# EAGLE design myBox (EAGLE 6.6.0)
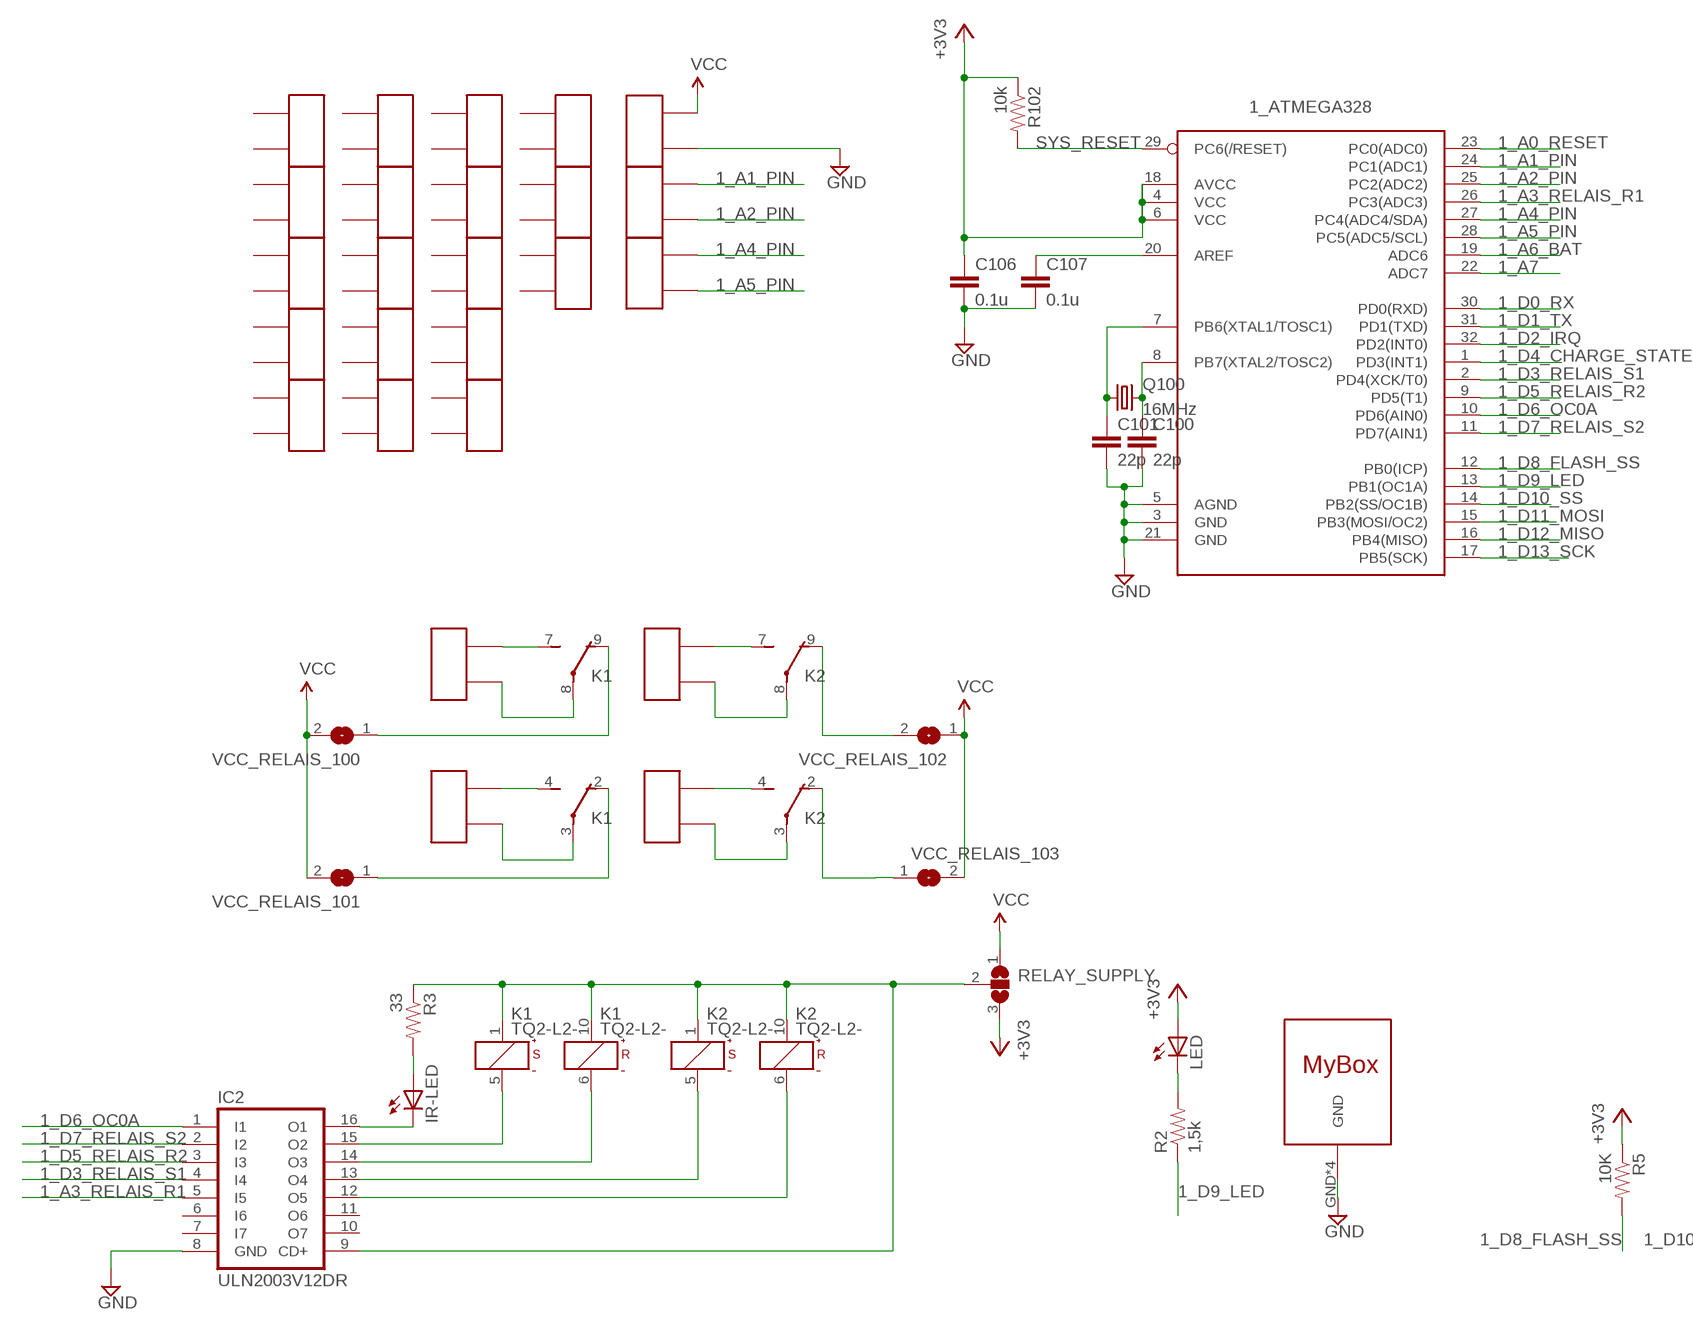
[diagram p0: schematic, sheet 1, part 1 of 2]
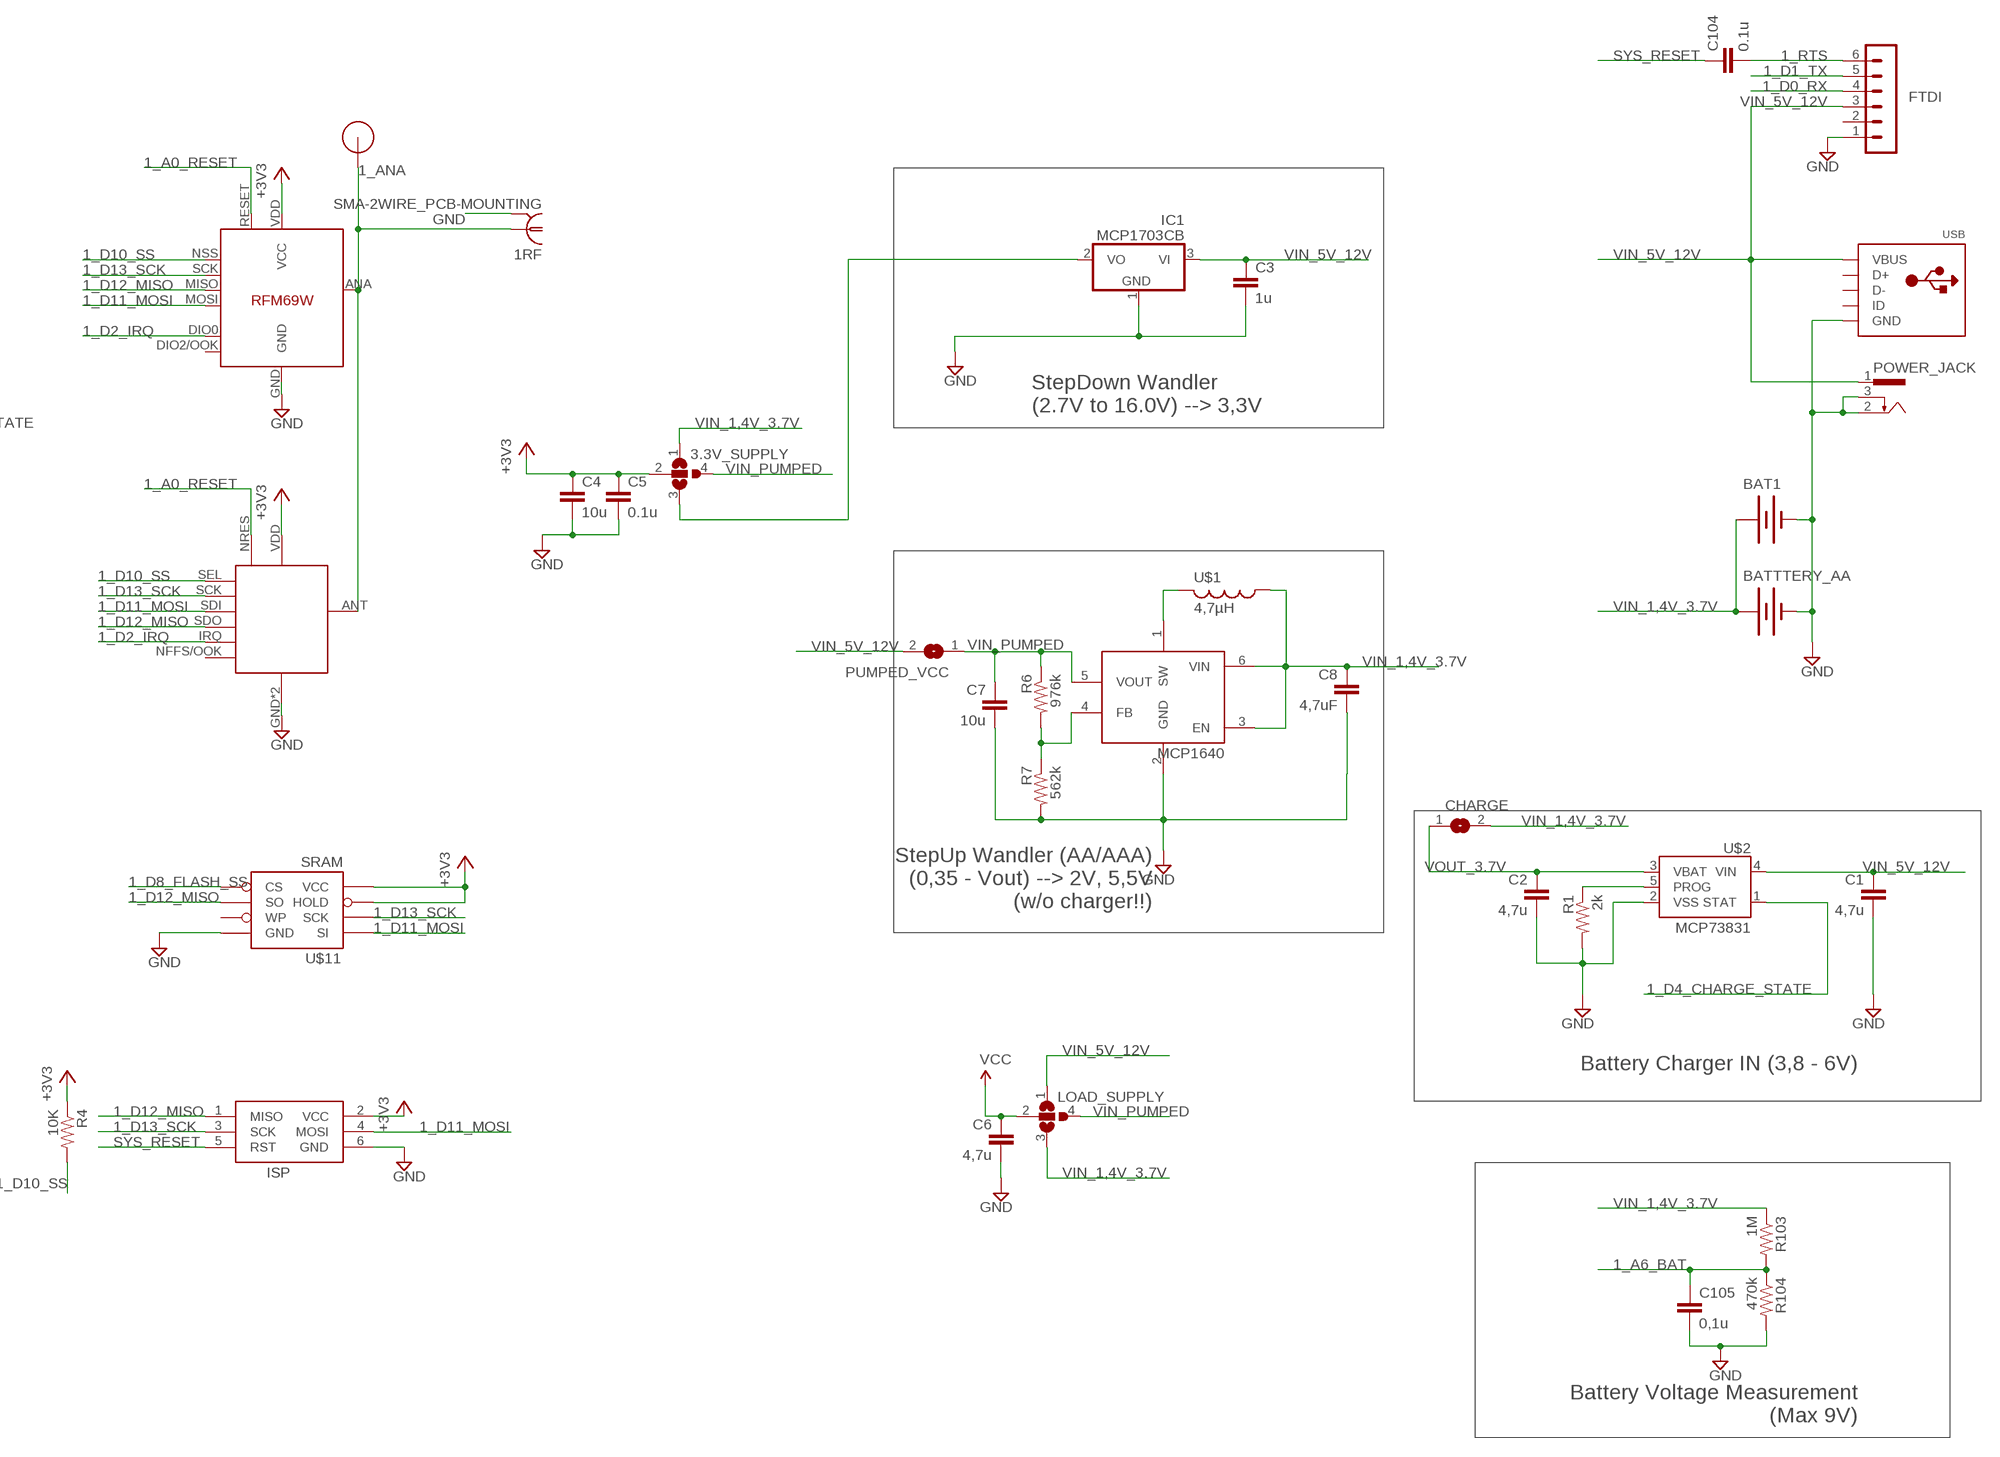
[diagram p1: schematic, sheet 1, part 2 of 2]

## Parts
1_ATMEGA328  ATMega-328  ATMEGA168/328TQFP32  [TQFP32-08]
1_RFM12  RFM12B_MINPADS  [RFM12B-MINPADS]
1_RFM69  RFM69_MINIPADS  [RFM69W-MINPADS]
1RF  SMA-2WIRE_PCB-MOUNTING  [J01151A0931]
3.3V_SUPPLY  SJ3W  [SJ_3]
ADC1  HDR_2PIN  [1X02_NS]
ADC2  HDR_2PIN  [1X02_NS]
BAT1  BATTERY  [BATTERY-CR2]
BATTTERY_AA  BATTERYAA  [BATTERY-AA]
C1  4,7u  CAP0603-CAP  [0603-CAP]
C2  4,7u  CAP0603-CAP  [0603-CAP]
C3  1u  CAP0603-CAP  [0603-CAP]
C4  10u  CAP0603-CAP  [0603-CAP]
C5  0.1u  CAP0603-CAP  [0603-CAP]
C6  4,7u  CAP0603-CAP  [0603-CAP]
C7  10u  CAP0603-CAP  [0603-CAP]
C8  4,7uF  CAP0603-CAP  [0603-CAP]
C100  22p  CAP0603-CAP  [0603-CAP]
C101  22p  CAP0603-CAP  [0603-CAP]
C104  0.1u  CAP0603-CAP  [0603-CAP]
C105  0,1u  CAP0603-CAP  [0603-CAP]
C106  0.1u  CAP0603-CAP  [0603-CAP]
C107  0.1u  CAP0603-CAP  [0603-CAP]
CHARGE  SJ  [SJ]
FTDI  FTDI  MA06-1  [MA06-1]
IC1  MCP1703CB  [SOT23]
IC2  ULN2003V12DR  ULN2003AD  [SO16]
IR-LED  LED5MM  [LED5MM]
IR/RELAY_SATELLITE  MY-BOX  [MY-BOX]
ISP  AVRISP  [AVRISP-EDGE]
K1  TQ2-L2-  [TQ2]
K2  TQ2-L2-  [TQ2]
LED  LED3MM  [LED3MM]
LOAD_SUPPLY  SJ3W  [SJ_3]
POWER_JACK  LUMBERG_1613-200-62  [733980-62]
PUMPED_VCC  SJ  [SJ]
Q100  16MHz  CRYSTALHC49S  [HC49/S]
R1  2k  RESISTOR0603-RES  [0603-RES]
R2  1,5k  RESISTOR0603-RES  [0603-RES]
R3  33  RESISTOR0603-RES  [0603-RES]
R4  10K  RESISTOR0603-RES  [0603-RES]
R5  10K  RESISTOR0603-RES  [0603-RES]
R6  976k  RESISTOR0603-RES  [0603-RES]
R7  562k  RESISTOR0603-RES  [0603-RES]
R102  10k  RESISTOR0603-RES  [0603-RES]
R103  1M  RESISTOR0603-RES  [0603-RES]
R104  470k  RESISTOR0603-RES  [0603-RES]
RELAY_SUPPLY  SJ2W  [SJ_2]
U1  MCP1640  [SOT23-6]
U$1  4,7µH  INDUCTOR_B82462G  [INDUCTOR_EPCOS]
U$2  MCP73831  [SOT23-5]
U$3  HDR_2PIN  [1X02_NS]
U$4  HDR_2PIN  [1X02_NS]
U$5  HDR_2PIN  [1X02_NS]
U$6  HDR_2PIN  [1X02_NS]
U$7  HDR_2PIN  [1X02_NS]
U$8  HDR_2PIN  [1X02_NS]
U$9  HDR_2PIN  [1X02_NS]
U$10  HDR_2PIN  [1X02_NS]
U$11  SRAM  SRAM_32K256JEDEC_3.9MM  [LOWPOWERLAB_SO08]
U$12  HDR_2PIN  [1X02_NS]
U$13  HDR_2PIN  [1X02_NS]
U$14  HDR_2PIN  [1X02_NS]
U$15  HDR_2PIN  [1X02_NS]
U$16  HDR_2PIN  [1X02_NS]
U$17  HDR_2PIN  [1X02_NS]
U$18  RFM12B_ANTENNA  [RFM12B-ANTENNA]
U$19  HDR_2PIN  [1X02_NS]
U$20  HDR_2PIN  [1X02_NS]
U$21  HDR_2PIN  [1X02_NS]
U$22  HDR_2PIN  [1X02_NS]
U$23  HDR_2PIN  [1X02_NS]
U$24  HDR_2PIN  [1X02_NS]
U$25  HDR_2PIN  [1X02_NS]
U$26  HDR_2PIN  [1X02_NS]
USB  USBMINIB  [USB-MINIB]
VCC  HDR_2PIN  [1X02_NS]
VCC_RELAIS_100  SJ  [SJ]
VCC_RELAIS_101  SJ  [SJ]
VCC_RELAIS_102  SJ  [SJ]
VCC_RELAIS_103  SJ  [SJ]

## Nets
1_A0_RESET: 1_ATMEGA328.23(PC0(ADC0)) 1_RFM12.NRES 1_RFM69.RESET
1_A1_PIN: 1_ATMEGA328.24(PC1(ADC1)) ADC1.1
1_A2_PIN: 1_ATMEGA328.25(PC2(ADC2)) ADC1.2
1_A3_RELAIS_R1: 1_ATMEGA328.26(PC3(ADC3)) IC2.5(I5)
1_A4_PIN: 1_ATMEGA328.27(PC4(ADC4/SDA)) ADC2.1
1_A5_PIN: 1_ATMEGA328.28(PC5(ADC5/SCL)) ADC2.2
1_A6_BAT: 1_ATMEGA328.19(ADC6) C105.1 R103.2 R104.1
1_A7: 1_ATMEGA328.22(ADC7)
1_ANA [ANT]: 1_RFM12.ANT 1_RFM69.ANA(ANT) 1RF.1 U$18.P$1
1_AREF: 1_ATMEGA328.20(AREF) C107.1
1_D0_RX: 1_ATMEGA328.30(PD0(RXD)) FTDI.4
1_D1_TX: 1_ATMEGA328.31(PD1(TXD)) FTDI.5
1_D2_IRQ: 1_ATMEGA328.32(PD2(INT0)) 1_RFM12.IRQ 1_RFM69.DIO0(DIO0/IRQ)
1_D3_RELAIS_S1: 1_ATMEGA328.2(PD4(XCK/T0)) IC2.4(I4)
1_D4_CHARGE_STATE: 1_ATMEGA328.1(PD3(INT1)) U$2.1(STAT)
1_D5_RELAIS_R2: 1_ATMEGA328.9(PD5(T1)) IC2.3(I3)
1_D6_OC0A: 1_ATMEGA328.10(PD6(AIN0)) IC2.1(I1)
1_D7_RELAIS_S2: 1_ATMEGA328.11(PD7(AIN1)) IC2.2(I2)
1_D8_FLASH_SS: 1_ATMEGA328.12(PB0(ICP)) R5.2 U$11.1_CS(CS)
1_D9_LED: 1_ATMEGA328.13(PB1(OC1A)) R2.1
1_D10_SS: 1_ATMEGA328.14(PB2(SS/OC1B)) 1_RFM12.SEL 1_RFM69.NSS(SEL) R4.2
1_D11_MOSI: 1_ATMEGA328.15(PB3(MOSI/OC2)) 1_RFM12.SDI(SDI/MOSI) 1_RFM69.MOSI ISP.4(MOSI) U$11.5_SI(SI)
1_D12_MISO: 1_ATMEGA328.16(PB4(MISO)) 1_RFM12.SDO(SDO/MISO) 1_RFM69.MISO ISP.1(MISO) U$11.2_SO(SO)
1_D13_SCK: 1_ATMEGA328.17(PB5(SCK)) 1_RFM12.SCK 1_RFM69.SCK ISP.3(SCK) U$11.6_SCK(SCK)
1_RTS: C104.2 FTDI.6
+3V3 [power]: 1_ATMEGA328.4(VCC) 1_ATMEGA328.6(VCC) 1_ATMEGA328.18(AVCC) 1_RFM12.VDD 1_RFM69.VDD(VCC) 3.3V_SUPPLY.2 C4.1 C5.1 C106.1 ISP.2(VCC) LED.A R4.1 R5.1 R102.1 RELAY_SUPPLY.3 U$11.7_HOLD(HOLD) U$11.8_VCC(VCC)
GND [power]: 1_ATMEGA328.3(GND) 1_ATMEGA328.5(AGND) 1_ATMEGA328.21(GND) 1_RFM12.GND 1_RFM12.GND1(GND) 1_RFM69.GND 1RF.G@1 1RF.G@2 1RF.G@3 1RF.G@4 BAT1.GND@1(-) BATTTERY_AA.GND@1(-) C1.2 C2.2 C3.2 C4.2 C5.2 C6.2 C7.2 C8.2 C100.2 C101.2 C105.2 C106.2 C107.2 FTDI.1 IC1.1(GND) IC2.8(GND) IR/RELAY_SATELLITE.GND IR/RELAY_SATELLITE.GND1(GND) IR/RELAY_SATELLITE.GND2(GND) IR/RELAY_SATELLITE.GND3(GND) ISP.6(GND) POWER_JACK.2 POWER_JACK.3 R1.2 R7.2 R104.2 U1.2(GND) U$2.2(VSS) U$11.4_GND(GND) USB.GND VCC.2
N$1: 1_ATMEGA328.7(PB6(XTAL1/TOSC1)) C101.1 Q100.1
N$2: R1.1 U$2.5(PROG)
N$3: IR-LED.A R3.2
N$4: IC2.16(O1) IR-LED.K(C)
N$5: IC2.15(O2) K1.5(S:-)
N$6: IC2.14(O3) K1.6(R:-)
N$7: 1_ATMEGA328.8(PB7(XTAL2/TOSC2)) C100.1 Q100.2
N$9 [power]: 3.3V_SUPPLY.3 IC1.2(VO)
N$10 [high_power]: K2.3(1:P) U$24.1
N$12 [high_power]: K1.4(1:S) U$22.2
N$13 [high_power]: K1.8(2:P) U$21.1
N$14 [high_power]: K1.7(2:S) U$21.2
N$15: IC2.13(O4) K2.5(S:-)
N$16: IC2.12(O5) K2.6(R:-)
N$17 [high_power]: K2.8(2:P) U$23.1
N$18 [high_power]: K2.4(1:S) U$24.2
N$19 [high_power]: K2.7(2:S) U$23.2
N$20 [high_power]: K1.3(1:P) U$22.1
N$21 [high_power]: K1.2(1:O) VCC_RELAIS_101.1
N$22: LED.K(C) R2.2
N$23 [power]: IC2.9(CD+) K1.1(S:+) K1.10(R:+) K2.1(S:+) K2.10(R:+) R3.1 RELAY_SUPPLY.2
N$24 [high_power]: K2.2(1:O) VCC_RELAIS_103.1
N$25 [high_power]: K1.9(2:O) VCC_RELAIS_100.1
N$26 [high_power]: K2.9(2:O) VCC_RELAIS_102.2
N$27: U1.1(SW) U$1.P$2
N$29: R6.2 R7.1 U1.4(FB)
SYS_RESET: 1_ATMEGA328.29(PC6(/RESET)) C104.1 ISP.5(RST) R102.2
VCC [high_power]: C6.1 LOAD_SUPPLY.2 RELAY_SUPPLY.1 VCC.1 VCC_RELAIS_100.2 VCC_RELAIS_101.2 VCC_RELAIS_102.1 VCC_RELAIS_103.2
VIN_1,4V_3.7V: 3.3V_SUPPLY.1 BAT1.PWR@1(+) BATTTERY_AA.PWR@1(+) C8.1 CHARGE.2 LOAD_SUPPLY.3 R103.1 U1.3(EN) U1.6(VIN) U$1.P$1
VIN_5V_12V: C1.1 C3.1 FTDI.3 IC1.3(VI) LOAD_SUPPLY.1 POWER_JACK.1 PUMPED_VCC.2 U$2.4(VIN) USB.VBUS
VIN_PUMPED [power]: 3.3V_SUPPLY.4 C7.1 LOAD_SUPPLY.4 PUMPED_VCC.1 R6.1 U1.5(VOUT)
VOUT_3.7V: C2.1 CHARGE.1 U$2.3(VBAT)
Unconnected: 1_RFM12.NFFS/OOK 1_RFM69.DIO2/OOK FTDI.2 IC2.6(I6) IC2.7(I7) IC2.10(O7) IC2.11(O6) U$3.1 U$3.2 U$4.1 U$4.2 U$5.1 U$5.2 U$6.1 U$6.2 U$7.1 U$7.2 U$8.1 U$8.2 U$9.1 U$9.2 U$10.1 U$10.2 U$11.3_WP(WP) U$12.1 U$12.2 U$13.1 U$13.2 U$14.1 U$14.2 U$15.1 U$15.2 U$16.1 U$16.2 U$17.1 U$17.2 U$19.1 U$19.2 U$20.1 U$20.2 U$25.1 U$25.2 U$26.1 U$26.2 USB.D+ USB.D- USB.ID

## Notes on the sheet
- StepDown Wandler 
  (2.7V to 16.0V) --> 3,3V
- StepUp Wandler (AA/AAA)
  (0,35 - Vout) --> 2V, 5,5V
  (w/o charger!!)
- Battery Charger IN (3,8 - 6V)
- Battery Voltage Measurement
  (Max 9V)

## Library data of the parts
1_ATMEGA328 = myLib:ATMEGA168/328: Atmel 32-pin 8-bit micro, 16k flash.; BUERKLIN: 64 S 3046
1_RFM12 = myLib:RFM12B_MINPADS
1_RFM69 = myLib:RFM69_MINIPADS
1RF = myLib:SMA-2WIRE_PCB-MOUNTING: SMA 50 Ohm Straight Jack Receptacle - PCB Mountung www.telegaertner.de Source: Buerklin Artikelnummer: J01151A0931; BUERKLIN: 76F410
3.3V_SUPPLY LOAD_SUPPLY = myLib:SJ3W: SMD solder JUMPER
ADC1 ADC2 U$3-U$10 U$12-U$17 U$19-U$26 VCC = myLib:HDR_2PIN
BAT1 = myLib:BATTERY: Battery Holders Various common sizes : AA, AAA, 20mm coin cell and 12mm coin cell.
BATTTERY_AA = myLib:BATTERY: Battery Holders Various common sizes : AA, AAA, 20mm coin cell and 12mm coin cell.; CONRAD: 651036 - 62
C1-C3 C6 C105 = LowPowerLab:CAP: Capacitor Standard 0603 ceramic capacitor, and 0.1" leaded capacitor.; BUERKLIN: 53D1660
C4 C7 = LowPowerLab:CAP: Capacitor Standard 0603 ceramic capacitor, and 0.1" leaded capacitor.; BUERKLIN: 53 D 1652
C5 C104 C106 C107 = LowPowerLab:CAP: Capacitor Standard 0603 ceramic capacitor, and 0.1" leaded capacitor.; BUERKLIN: 53 D 1726
C8 = LowPowerLab:CAP: Capacitor Standard 0603 ceramic capacitor, and 0.1" leaded capacitor.; BUERKLIN: 53 D 1659
C100 C101 = LowPowerLab:CAP: Capacitor Standard 0603 ceramic capacitor, and 0.1" leaded capacitor.; BUERKLIN: 53 D 1676
CHARGE PUMPED_VCC VCC_RELAIS_100-VCC_RELAIS_103 = jumper:SJ: SMD solder JUMPER
FTDI = JeeLabs:MA06-1: PIN HEADER; BUERKLIN: 59 F 2134
IC1 = linear:MCP1703: 250 mA, 16V, Low Quiescent Current LDO Regulator Source: http://ww1.microchip.com/downloads/en/DeviceDoc/22049b.pdf; CONRAD: 651422 - 62
IC2 = uln-udn:ULN2003A: DRIVER ARRAY; CONRAD: 1187534 - 62
IR-LED = led:LED: LED
IR/RELAY_SATELLITE = myLib:MY-BOX; CONRAD: 522651
ISP = myLib:AVRISP: AVR ISP HEADER Standard 6 pin header for AVR programming; BUERKLIN: 56F6228; CONRAD: 737480-62
K1 K2 = relay:TQ2?-L2-*: LOW PROFILE 2 FORM C RELAY NAiS 2 coil latching Source: http://www.mew-europe.com/.. en_ds_61020_0001.pdf Source: http://www.mew-europe.com/.. en_ds_61020_0002.pdf; BUERKLIN: 30 G 7570; MF: AROMAT/ MATSUSHITA; MPN: TQ2-L2-3V; OC_FARNELL: 1217662; OC_NEWARK: 64K3196
LED = adafruit:LED: LED
POWER_JACK = myLib:LUMBERG_1613-20: FEMALE PRINT CONNECTOR Niedervolt-Steckverbinder Distributor Conrad; BUERKLIN: 40 F 144
Q100 = crystal:CRYSTAL: CRYSTAL; BUERKLIN: 78D428; OC_FARNELL: 1667008; OC_NEWARK: unknown
R1 R4-R7 R102-R104 = LowPowerLab:RESISTOR: Resistor Basic schematic elements and footprints for 0603, 1206, and PTH resistors.; BUERKLIN: 26 E 816
R2 = LowPowerLab:RESISTOR: Resistor Basic schematic elements and footprints for 0603, 1206, and PTH resistors.; BUERKLIN: 26 E 778
R3 = LowPowerLab:RESISTOR: Resistor Basic schematic elements and footprints for 0603, 1206, and PTH resistors.; BUERKLIN: 26 E 756
RELAY_SUPPLY = myLib:SJ2W: SMD solder JUMPER
U1 = myLib:MCP1640: MCP1623, 1624, 1640/B/C/D pwm/pfm or pwm only DC/DC converters, in SOT-23; CONRAD-MCP1640C: 651406 - 62
U$1 = myLib:INDUCTOR; BUERKLIN_EPCOS: 73 D 9010
U$2 = myLib:MCP73831: Microchip's MCP73831 Miniature single cell, fully integrated Li-Ion, Li-polymer charge management controller http://ww1.microchip.com/downloads/en/DeviceDoc/21984a.pdf; CONRAD: 651522 - 62
U$11 = myLib:SRAM_32K256: 4-Mbit SPI flash memory; CONRAD: 651216 - 62
U$18 = LowPowerLab:RFM12B_ANTENNA
USB = myLib:USB: USB Connectors USBMINIB - Surface Mount Female Mini-B USB Connector 4UConnector: 06564 By microbuilder.eu Thru-hole RA Female Mini-B USB Connector 4UConnector: 18732 By ladyada.net

## Net classes
1 power: width 0.381 mm, clearance 0.254 mm
2 ANT: width 0.381 mm, clearance 0.254 mm
3 high_power: width 0.635 mm, clearance 0.508 mm

## Board
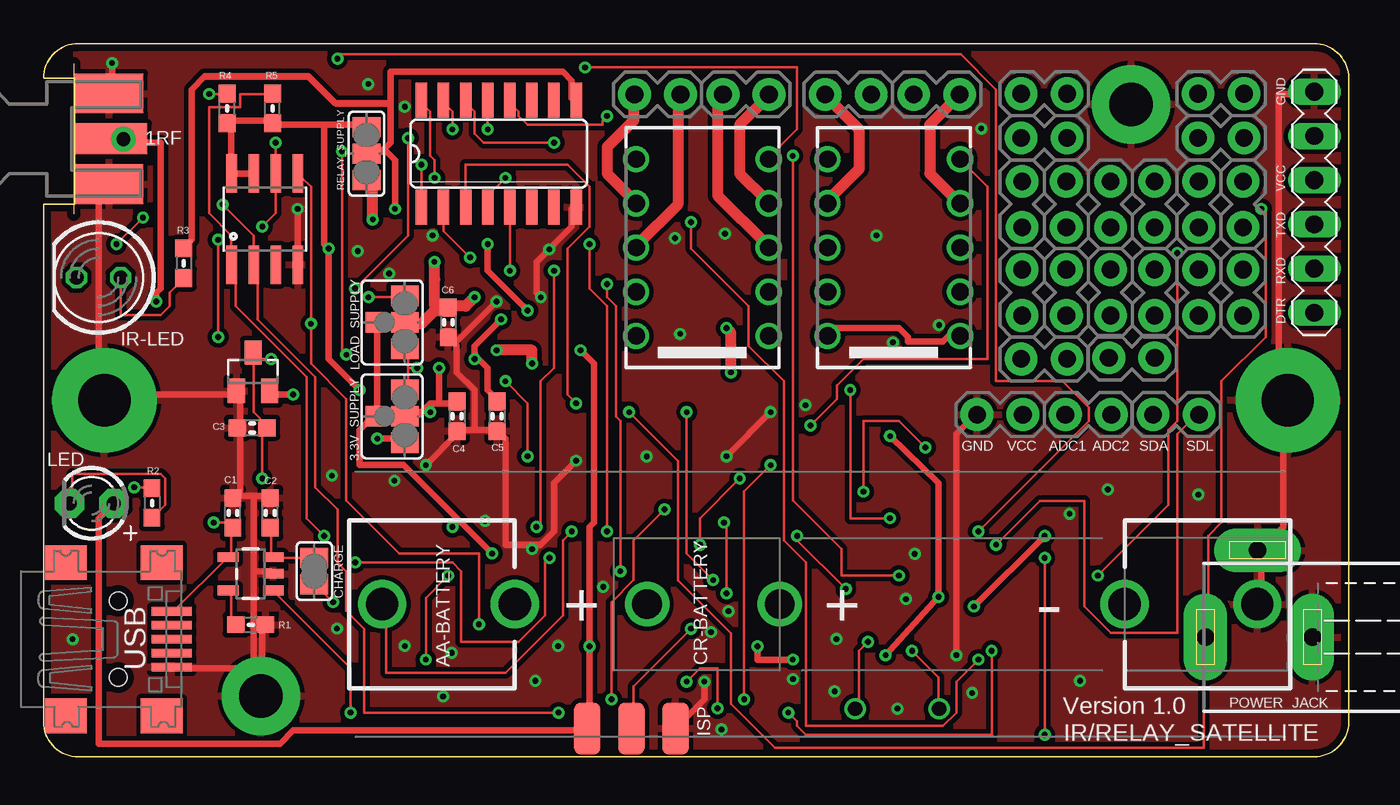
[diagram p2: board, top side]
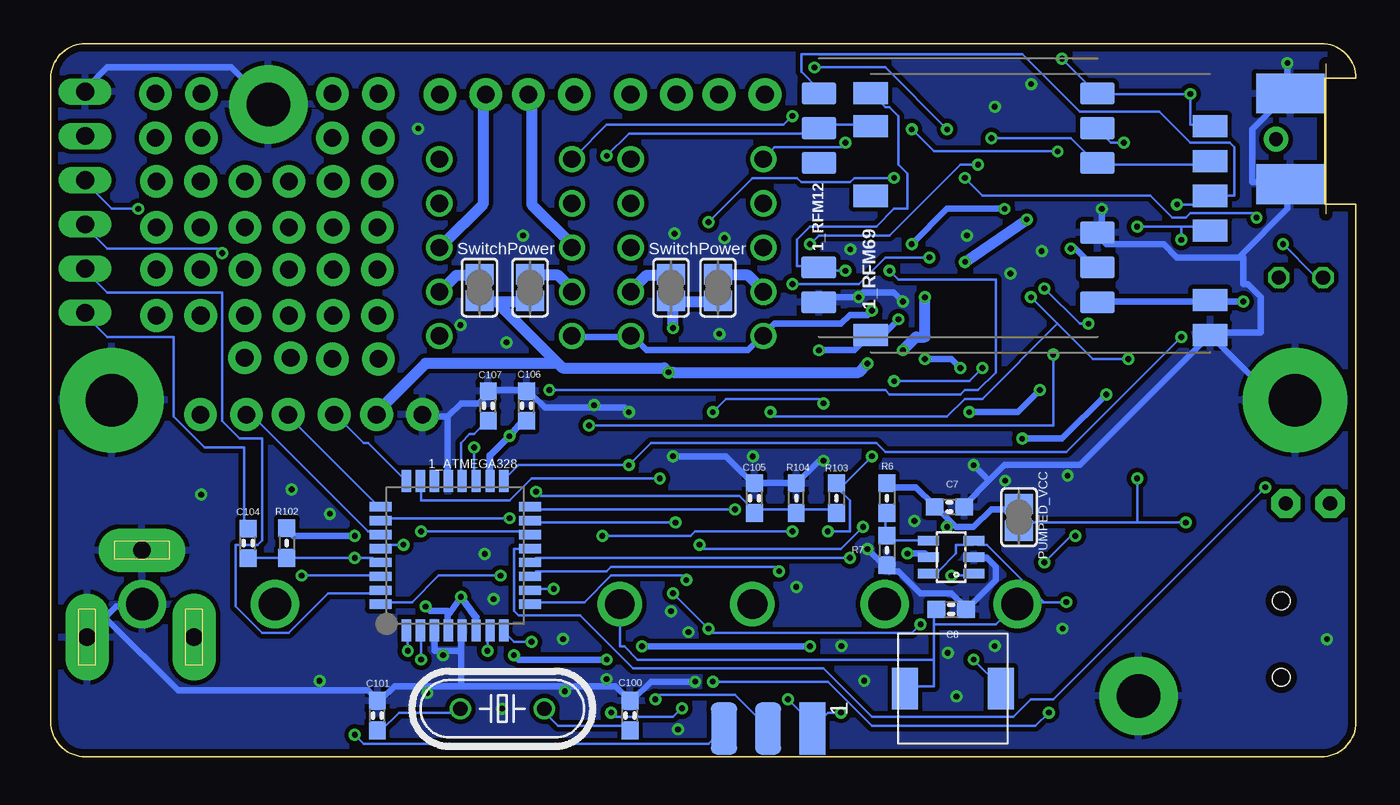
[diagram p3: board, bottom side, seen from below]

Size 75 x 41 mm. Coordinates in mm from the lower left corner, seen from the top.
Copper layers (1*16): Top 0.0356mm / dielectric 1.5011mm / Bottom 0.0356mm
Design rules "LaenPCBOrder": minimum track width 6mil, minimum drill 13mil, track to track 6mil, track to pad 6mil, pad to pad 6mil, via to via 6mil, smd to smd 6mil, copper to edge 15mil, drill to drill 6mil, minimum pad ring 7mil, minimum via ring 7mil, stop-mask expansion 3mil, vias tented up to drill 0mil, thermal gap 10mil

### Footprints (pad centres in the part's own frame; a part is rotated, then mirrored left to right if it is on the bottom)
TQFP32-08 = smd 1.27 x 0.533: 1 -4.293,2.8; 2 -4.293,2; 3 -4.293,1.2; 4 -4.293,0.4; 5 -4.293,-0.4; 6 -4.293,-1.2; 7 -4.293,-2; 8 -4.293,-2.8; 17 4.293,-2.8; 18 4.293,-2; 19 4.293,-1.2; 20 4.293,-0.4; 21 4.293,0.4; 22 4.293,1.2; 23 4.293,2; 24 4.293,2.8 | smd 0.533 x 1.27: 9 -2.8,-4.293; 10 -2,-4.293; 11 -1.2,-4.293; 12 -0.4,-4.293; 13 0.4,-4.293; 14 1.2,-4.293; 15 2,-4.293; 16 2.8,-4.293; 25 2.8,4.293; 26 2,4.293; 27 1.2,4.293; 28 0.4,4.293; 29 -0.4,4.293; 30 -1.2,4.293; 31 -2,4.293; 32 -2.8,4.293
RFM12B-MINPADS = smd 2 x 1.27: ANT 8,-6; GND 8,-2; GND1 -8.002,-6.001; IRQ -8,4; NFFS/OOK -8,2; NRES -8.002,-4; SCK 8,4; SDI 8,2; SDO -8,6; SEL 8,6; VDD 8,-4
RFM69W-MINPADS = smd 2 x 1.27: ANA 8,-5; DIO0 -11.5,5; DIO2/OOK -11.5,1; GND 8,-7; MISO 8,1; MOSI 8,3; NSS 8,5; RESET -11.5,6.909; SCK 8,-1; VDD -11.5,-7
J01151A0931 = smd 4.191 x 1.778: 1 2.134,0 | smd 3.937 x 2.286: G@1 2.032,2.6; G@2 2.032,-2.6 | smd 3.937 x 2.286 bottom: G@3 2.032,2.6; G@4 2.032,-2.6
SJ_3 = smd 1.168 x 1.6: 1 -1.524,0; 2 0,0; 3 1.524,0 | smd 1.168 x 1.168: 4 0,-1.67
1X02_NS = drill 1.016 pad 1.88: 1 -1.321,0; 2 1.321,0
BATTERY-CR2 = drill 1.702: GND@1 17.272,0; GND@2 9.652,0; PWR@1 -10.16,0; PWR@2 -17.78,0
BATTERY-AA = drill 1.854: GND@1 25.146,0; GND@2 17.526,0; PWR@1 -25.146,0; PWR@2 -17.526,0
0603-CAP = smd 1.016 x 0.965: 1 -0.85,0; 2 0.85,0
SJ = smd 1.168 x 1.6: 1 -0.762,0; 2 0.762,0
MA06-1 = drill 1.016 long: 1 0,0; 2 2.54,0; 3 5.08,0; 4 7.62,0; 5 10.16,0; 6 12.7,0
SOT23 = smd 1 x 1.4: 1 -0.95,-1.1; 2 0.95,-1.1; 3 0,1.1
SO16 = smd 0.66 x 2.032: 1 -4.445,-3.073; 2 -3.175,-3.073; 3 -1.905,-3.073; 4 -0.635,-3.073; 5 0.635,-3.073; 6 1.905,-3.073; 7 3.175,-3.073; 8 4.445,-3.073; 9 4.445,3.073; 10 3.175,3.073; 11 1.905,3.073; 12 0.635,3.073; 13 -0.635,3.073; 14 -1.905,3.073; 15 -3.175,3.073; 16 -4.445,3.073
LED5MM = drill 0.813 octagon: A -1.27,0; K 1.27,0
MY-BOX = drill 2.5 pad 4.5: GND 12.5,3.5; GND1 62.5,37.5 | drill 3 pad 6: GND2 3.5,20.5; GND3 71.5,20.5
AVRISP-EDGE = smd 3 x 1.5: 1 1.5,2.54; 3 1.5,0; 5 1.5,-2.54 | smd 3 x 1.5 bottom: 2 1.5,2.54; 4 1.5,0; 6 1.5,-2.54
TQ2 = drill 1: 1 -5.08,-3.81; 2 -2.54,-3.81; 3 0,-3.81; 4 2.54,-3.81; 5 5.08,-3.81; 6 5.08,3.81; 7 2.54,3.81; 8 0,3.81; 9 -2.54,3.81; 10 -5.08,3.81
LED3MM = drill 0.813 pad 1.676 octagon: A -1.27,0; K 1.27,0
733980-62 = drill 1 pad 2.5 long: 1 0,8.57; 2 0,2.42; 3 5,5.57
HC49/S = drill 0.813: 1 -2.413,0; 2 2.413,0
0603-RES = smd 1.016 x 0.965: 1 -0.85,0; 2 0.85,0
SJ_2 = smd 1.168 x 1.6: 1 -1.524,0; 2 0,0; 3 1.524,0
SOT23-6 = smd 0.55 x 1.2: 1 -0.95,-1.3; 2 0,-1.3; 3 0.95,-1.3; 4 0.95,1.3; 5 0,1.3; 6 -0.95,1.3
INDUCTOR_EPCOS = smd 1.5 x 2.4: P$1 -2.75,3.15; P$2 2.75,3.15
SOT23-5 = smd 0.55 x 1.2: 1 -0.95,-1.3; 2 0,-1.3; 3 0.95,-1.3; 4 0.95,1.3; 5 -0.95,1.3
LOWPOWERLAB_SO08 = smd 0.61 x 2.21: 1_CS -1.905,-2.616; 2_SO -0.635,-2.616; 3_WP 0.635,-2.616; 4_GND 1.905,-2.616; 5_SI 1.905,2.616; 6_SCK 0.635,2.616; 7_HOLD -0.635,2.616; 8_VCC -1.905,2.616
RFM12B-ANTENNA = drill 0.8 pad 1.422: P$1 0,0
USB-MINIB = smd 0.5 x 2.308: D+ 0,4.064; D- -0.8,4.064; GND 1.6,4.064; ID 0.8,4.064; VBUS -1.6,4.064 | smd 2 x 2.4: GND1 -4.4,-2; GND2 -4.4,3.5; GND3 4.4,3.5; GND4 4.4,-2 | hole 1: -2.2,1; 2.2,1

### Placement (x,y rotation side)
1_ATMEGA328  51.76,11.57 90 bottom
1_RFM12  22.86,32.13 0 bottom
1_RFM69  16.38,31.24 0 bottom
1RF  1.73,35.52 0 top
3.3V_SUPPLY  20.76,19.57 270 top
ADC1  60.04,19.67 0 top
ADC2  65.08,19.67 0 top
BAT1  52.46,8.77 0 top
BATTTERY_AA  44.6,8.77 0 top
C1  10.88,14.02 90 top
C2  13.03,14.02 90 top
C3  11.99,18.91 180 top
C4  23.76,19.57 270 top
C5  26.06,19.57 270 top
C6  23.26,24.97 270 top
C7  23.36,14.37 0 bottom
C8  23.26,8.47 0 bottom
C100  41.71,2.37 90 bottom
C101  56.23,2.37 90 bottom
C104  63.66,12.27 90 bottom
C105  34.56,14.87 90 bottom
C106  47.66,20.17 90 bottom
C107  49.86,20.17 90 bottom
CHARGE  15.56,10.67 270 top
FTDI  73.02,38.23 270 top
IC1  12.04,22.13 0 top
IC2  26.16,34.67 0 top
IR-LED  3.16,27.55 180 top
IR/RELAY_SATELLITE  0,0 0 top
ISP  33.78,3.13 270 bottom
K1  37.86,29.27 90 top
K2  48.86,29.27 90 top
LED  2.76,14.57 180 top
LOAD_SUPPLY  20.76,24.97 270 top
POWER_JACK  75.34,6.88 90 top
PUMPED_VCC  19.36,13.77 270 bottom
Q100  49.05,2.77 0 bottom
R1  11.91,7.59 0 top
R2  6.23,14.59 270 top
R3  8.06,28.37 270 top
R4  10.56,37.27 90 top
R5  13.16,37.27 90 top
R6  26.96,14.87 270 bottom
R7  26.96,11.87 270 bottom
R102  61.44,12.29 270 bottom
R103  29.86,14.87 270 bottom
R104  32.16,14.87 90 bottom
RELAY_SUPPLY  18.56,34.67 90 top
U1  23.26,11.47 90 bottom
U$1  23.16,0.77 0 bottom
U$2  11.91,10.52 90 top
U$3  57.5,22.87 180 top
U$4  62.54,22.93 0 top
U$5  56.23,26.68 270 top
U$6  58.77,26.68 270 top
U$7  61.31,26.68 270 top
U$8  63.85,26.68 270 top
U$9  66.39,26.68 270 top
U$10  68.93,26.68 270 top
U$11  12.72,30.91 0 top
U$12  56.23,31.76 270 top
U$13  58.77,31.76 270 top
U$14  61.31,31.76 270 top
U$15  63.85,31.76 270 top
U$16  66.39,31.76 270 top
U$17  68.93,31.76 270 top
U$18  4.59,35.5 0 top
U$19  57.5,35.57 180 top
U$20  67.66,35.57 180 top
U$21  35.28,38.07 180 top
U$22  40.36,38.07 0 top
U$23  46.24,38.07 180 top
U$24  51.32,38.07 0 top
U$25  57.5,38.11 180 top
U$26  67.66,38.11 180 top
USB  3.3,6.76 270 top
VCC  54.96,19.67 180 top
VCC_RELAIS_100  36.66,26.97 270 bottom
VCC_RELAIS_101  39.36,26.97 270 bottom
VCC_RELAIS_102  47.46,26.97 90 bottom
VCC_RELAIS_103  50.36,26.97 270 bottom

### Tracks (layer width: path | path; a pad name or v marks a point on that pad's centre or on a via)
1_A0_RESET  (via drill 0.33)
  Top 0.152: v40.01,16 37.72,13.72 v37.72,12.19 | v28.32,13.21 28.57,13.46 28.57,21.59 29.34,22.35 v29.34,27.94
  Bottom 0.152: v40.01,16 47.37,16 48.64,14.73 53.72,14.73 53.72,15.75 1_ATMEGA328.23 | v37.72,12.19 37.47,11.94 29.59,11.94 v28.32,13.21 | v29.34,27.94 30.86,27.94 1_RFM12.NRES 31.11,28.19 32.13,28.19 32.13,29.72 31.37,30.48 27.56,30.48 26.54,31.5 25.78,31.5 25.78,33.53 26.29,34.04 26.29,36.83 26.8,37.34 27.05,37.34 27.81,38.1 1_RFM69.RESET
1_A1_PIN
  Bottom 0.152: 1_ATMEGA328.24 54.74,16 56.77,18.03 57.02,18.03 58.55,19.56 ADC1.1
1_A2_PIN
  Bottom 0.152: 1_ATMEGA328.25 56.26,14.48 61.34,19.56 ADC1.2
1_A3_RELAIS_R1  (via drill 0.33)
  Top 0.152: v48.64,13.72 46.36,13.72 v46.36,21.08 | v26.8,27.94 26.8,31.5 IC2.5
  Bottom 0.152: v48.64,13.72 56.01,13.72 1_ATMEGA328.26 | v46.36,21.08 27.05,21.08 26.8,20.83 22.73,20.83 22.48,21.08 21.72,21.08 20.7,22.1 20.7,27.43 26.29,27.43 v26.8,27.94
1_A4_PIN
  Bottom 0.152: 1_ATMEGA328.27 56.26,12.95 56.77,12.95 63.37,19.56 63.63,19.56 ADC2.1
1_A5_PIN  (via drill 0.33)
  Top 0.152: v54.74,12.19 57.26,14.72 59.82,14.72 59.82,8.64 61.34,7.11 65.15,7.11 65.15,18.54 66.17,19.56 ADC2.2
  Bottom 0.152: v54.74,12.19 56.01,12.19 1_ATMEGA328.28
1_A6_BAT  (via drill 0.33)
  Top 0.152: v50.67,17.78 49.15,19.3 47.12,19.3 v47.12,15.24
  Bottom 0.152: R103.2 30.1,14.22 32.13,14.22 R104.1 32.39,14.22 34.42,14.22 C105.1 34.67,14.22 35.43,14.99 46.86,14.99 v47.12,15.24 | 50.42,16 1_ATMEGA328.19 50.67,16 v50.67,17.78
1_ANA  (via drill 0.33)
  Top 0.381: 1RF.1 3.94,35.56 4.44,35.56 U$18.P$1 4.7,35.31 6.73,35.31 6.73,26.92 6.48,26.67 v6.48,26.16
  Bottom 0.381: 1_RFM12.ANT 14.86,26.16 8.51,26.16 1_RFM69.ANA 8.25,26.16 v6.48,26.16
1_AREF
  Bottom 0.152: C107.1 49.91,19.3 50.67,18.54 50.93,18.54 51.44,18.03 51.44,16 1_ATMEGA328.20
1_D0_RX  (via drill 0.33)
  Top 0.152: v60.58,10.41 64.64,14.48 64.64,18.8 65.15,19.3 v65.15,28.96
  Bottom 0.152: v60.58,10.41 56.26,10.41 1_ATMEGA328.30 | v65.15,28.96 65.41,29.21 71.75,29.21 73.02,30.48 FTDI.4
1_D1_TX
  Bottom 0.152: 1_ATMEGA328.31 56.26,9.4 59.05,9.4 61.34,7.11 62.87,7.11 64.39,8.64 64.39,12.19 63.12,12.19 62.87,12.45 62.87,18.29 64.13,18.29 65.15,19.3 65.15,26.67 71.75,26.67 73.02,27.94 FTDI.5
1_D2_IRQ  (via drill 0.33)
  Top 0.152: v49.15,10.41 45.85,10.41 45.85,11.94 43.05,14.73 v43.05,34.54
  Bottom 0.152: v49.15,10.41 52.71,10.41 54.23,8.89 56.01,8.89 1_ATMEGA328.32 | v43.05,34.54 41.78,35.81 31.11,35.81 30.86,36.07 1_RFM12.IRQ 30.61,36.32 28.07,36.32 1_RFM69.DIO0
1_D3_RELAIS_S1  (via drill 0.33)
  Top 0.152: v53.72,5.59 52.45,4.32 52.45,2.54 51.69,1.78 43.82,1.78 43.82,11.18 42.55,12.45 42.55,21.59 40.51,23.62 40.51,25.91 37.21,29.21 v37.21,30.73 | v26.54,33.27 25.53,32.26 25.53,31.75 IC2.4
  Bottom 0.152: v53.72,5.59 53.72,7.11 1_ATMEGA328.2 | v37.21,30.73 34.67,33.27 32.13,33.27 31.88,33.02 29.08,33.02 28.83,33.27 v26.54,33.27
1_D4_CHARGE_STATE  (via drill 0.33)
  Top 0.152: v17.65,2.54 17.65,5.08 13.34,9.4 U$2.1 | v36.96,4.32 37.72,5.08 38.73,5.08 v38.73,2.79 | v42.8,2.54 43.31,2.03 43.31,1.78 43.82,1.27 54.48,1.27 v54.48,6.1
  Bottom 0.152: v17.65,2.54 18.41,1.78 27.81,1.78 30.35,4.32 v36.96,4.32 | v38.73,2.79 39.24,2.29 42.55,2.29 v42.8,2.54 | v54.48,6.1 54.48,7.11 1_ATMEGA328.1
1_D5_RELAIS_R2  (via drill 0.33)
  Top 0.152: v38.48,10.16 36.96,11.68 v36.96,19.81 | v30.61,20.32 30.1,20.83 30.1,29.21 31.37,30.48 31.37,32.77 30.1,34.04 24.26,34.04 24.26,31.75 IC2.3
  Bottom 0.152: v38.48,10.16 38.73,10.41 42.8,10.41 44.32,8.89 47.37,8.89 1_ATMEGA328.9 | v36.96,19.81 36.2,20.57 30.86,20.57 v30.61,20.32
1_D6_OC0A  (via drill 0.33)
  Top 0.152: v46.1,9.65 43.31,12.45 v43.31,12.7 | v32.39,12.95 32.39,25.91 31.37,26.92 v31.37,29.46 | v21.72,34.04 21.72,31.75 IC2.1
  Bottom 0.152: v46.1,9.65 47.37,9.65 1_ATMEGA328.10 | v43.31,12.7 38.23,12.7 37.97,12.95 v32.39,12.95 | v31.37,29.46 30.86,29.97 26.8,29.97 22.73,34.04 v21.72,34.04
1_D7_RELAIS_S2  (via drill 0.33)
  Top 0.152: v33.15,10.67 33.15,19.3 32.89,19.56 32.89,25.91 32.39,26.42 v32.39,27.18 | v24.51,28.7 22.99,30.23 22.99,31.5 IC2.2
  Bottom 0.152: v33.15,10.67 33.4,10.92 42.8,10.92 43.05,10.67 47.12,10.67 47.37,10.41 1_ATMEGA328.11 | v32.39,27.18 28.57,27.18 27.05,28.7 v24.51,28.7
1_D8_FLASH_SS  (via drill 0.33)
  Top 0.152: R5.2 13.08,38.1 11.3,38.1 11.3,37.34 9.52,37.34 9.52,31.24 10.79,29.97 10.79,28.45 U$11.1_CS 11.05,28.19 11.05,25.91 15.11,21.84 15.11,13.72 v16.13,12.7 | v29.08,11.43 28.83,11.18 28.83,8.13 27.3,6.6 24,6.6 24,10.67 23.5,11.18 v17.91,11.18
  Bottom 0.152: v29.08,11.43 47.12,11.43 47.37,11.18 1_ATMEGA328.12 | v17.91,11.18 16.38,12.7 v16.13,12.7
1_D9_LED  (via drill 0.33)
  Top 0.152: v5.21,15.49 6.22,15.49 R2.1
  Bottom 0.152: v5.21,15.49 17.4,3.3 18.67,3.3 19.68,2.29 27.81,2.29 30.61,5.08 41.53,5.08 44.58,8.13 48.13,8.13 48.39,8.38 48.39,11.94 47.62,11.94 1_ATMEGA328.13
1_D10_SS  (via drill 0.33)
  Top 0.152: v9.52,38.1 10.54,38.1 R4.2 | v53.72,12.95 60.07,19.3 60.07,20.07 58.55,21.59 54.74,21.59 54.74,38.35 52.71,40.39 16.89,40.39 v16.89,40.13
  Bottom 0.152: 1_RFM69.NSS 8.51,36.32 9.52,36.32 v9.52,38.1 14.86,38.1 1_RFM12.SEL 15.11,38.35 v16.89,40.13 | v53.72,12.95 47.62,12.95 1_ATMEGA328.14
1_D11_MOSI  (via drill 0.33)
  Top 0.152: v39.1,13.46 39.24,13.21 v39.24,9.4 | v37.21,7.37 33.91,4.06 33.91,1.78 ISP.4 | v25.02,7.62 25.02,11.68 20.45,11.68 17.4,14.73 17.4,20.57 15.37,22.61 v15.37,24.89 15.37,32.77 14.86,33.27 U$11.5_SI | v20.95,35.56 20.95,29.97 v17.91,26.92
  Bottom 0.152: 1_RFM69.MOSI 8.51,34.04 14.86,34.04 1_RFM12.SDI 15.11,34.29 16.38,35.56 v20.95,35.56 | v39.1,13.46 47.37,13.46 1_ATMEGA328.15 | v39.24,9.4 v37.21,7.37 36.96,7.11 25.53,7.11 v25.02,7.62 | v17.91,26.92 15.88,24.89 v15.37,24.89
1_D12_MISO  (via drill 0.33)
  Top 0.152: v35.69,14.22 33.91,12.45 33.91,10.16 32.64,8.89 v32.64,3.3 | v10.29,31.75 12.06,29.97 12.06,28.45 U$11.2_SO 12.32,28.19 12.32,25.15 15.62,21.84 15.62,15.49 16.89,14.22 16.89,11.18 17.4,10.67 17.4,8.38 18.41,7.37 18.41,2.54 v29.59,2.54
  Bottom 0.152: v35.69,14.22 47.37,14.22 1_ATMEGA328.16 | 31.11,1.78 v32.64,3.3 | 31.11,1.78 ISP.1 31.11,1.78 | v10.29,31.75 8.76,31.75 8.51,32 1_RFM69.MISO 8.25,32.26 6.99,32.26 6.99,35.05 7.24,35.31 9.52,35.31 11.3,37.08 15.88,37.08 19.18,40.39 31.88,40.39 31.88,39.37 30.86,38.35 1_RFM12.SDO | 31.11,1.78 30.35,2.54 v29.59,2.54
1_D13_SCK  (via drill 0.33)
  Top 0.152: v12.57,30.48 13.34,31.24 13.34,33.27 U$11.6_SCK 13.34,33.53 v13.34,35.31 | v41.78,16.76 40.26,15.24 v40.26,3.3 | v10.03,24.13 v10.03,29.72
  Bottom 0.152: v12.57,30.48 10.03,30.48 | 10.03,30.48 8.51,30.48 1_RFM69.SCK | v13.34,35.31 14.1,35.31 14.86,36.07 1_RFM12.SCK | v40.26,3.3 40.01,3.56 35.69,3.56 33.91,1.78 ISP.3 | 1_ATMEGA328.17 48.9,16 48.13,16.76 v41.78,16.76 40.51,18.03 27.56,18.03 27.05,17.53 16.64,17.53 v10.03,24.13 | v10.03,29.72 10.03,30.48
1_RTS
  Bottom 0.152: C104.2 63.88,13.21 63.88,17.78 66.17,17.78 67.94,19.56 67.94,24.13 71.75,24.13 73.02,25.4 FTDI.6
+3V3  (via drill 0.33)
  Top 0.381: v48.65,18.43 51.44,15.75 v51.44,9.19 v48.39,5.84 | v53.47,8.64 v57.53,12.7 | U$11.7_HOLD 12.06,33.53 11.05,33.53 U$11.8_VCC 10.79,33.53 10.79,36.32 R4.1 10.79,36.58 13.08,36.58 R5.1 13.34,36.32 16.13,36.32 | 16.13,36.32 18.41,36.32 RELAY_SUPPLY.3 | 16.13,36.32 16.13,29.46 v16.38,29.21 16.38,22.86 v18.16,21.08 | 22.73,20.32 22.22,20.32 21.84,19.94 | 22.73,20.32 23.75,20.32 C4.1 | 21.84,19.94 21.72,19.81 20.95,19.81 3.3V_SUPPLY.2 | 24.89,22.99 24.76,23.11 24.76,23.62 v26.29,25.15 | 24.89,22.99 25.53,22.35 25.53,21.08 26.04,20.57 C5.1 | v22.73,22.35 22.73,20.32 | v24.76,22.86 24.89,22.99 | 31.37,1.78 ISP.2 | 31.37,1.78 ISP.2 | ISP.2 31.11,1.52 14.35,1.52 13.59,0.76 3.17,0.76 3.17,13.72 3.94,14.48 LED.A | v30.86,23.37 31.62,22.61 31.62,13.46 31.37,13.21 v31.37,6.35 31.37,1.78 | 31.37,1.78 ISP.2 | v22.22,19.81 21.97,19.81 21.84,19.94 | v43.05,5.59 41.02,5.59 v41.02,6.35
  Bottom 0.381: v48.65,18.43 47.88,19.3 C106.1 | 52.07,8.25 52.2,8.13 52.2,7.37 1_ATMEGA328.4 | 52.07,8.25 v51.44,9.19 | v57.53,12.7 61.09,12.7 61.34,12.95 R102.1 | v53.47,8.64 53.21,8.38 52.2,8.38 52.07,8.25 | v16.38,29.21 16.13,29.21 15.11,28.19 1_RFM12.VDD | v26.29,25.15 27.05,24.38 27.81,24.38 1_RFM69.VDD 28.07,24.13 28.83,23.37 v30.86,23.37 | v22.73,22.35 23.24,22.86 v24.76,22.86 | v18.16,21.08 19.43,19.81 v22.22,19.81 | v48.39,5.84 48.13,5.59 v43.05,5.59 | v31.37,6.35 v41.02,6.35
  Bottom 0.406: 1_ATMEGA328.6 50.56,8.02 v51.44,9.19 | 1_ATMEGA328.18 49.76,17.32 v48.65,18.43
GND  (via drill 0.33)
  Top 0.381: v28.57,26.42 28.32,26.67 28.32,28.45 30.35,30.48 30.35,31.5 IC2.8 | 24.76,18.8 26.04,18.8 C5.2 26.29,18.54 26.54,18.29 26.54,12.19 28.07,12.19 | 24.76,18.8 24,18.8 C4.2 23.75,18.54 v21.97,16.76 | 23.62,23.75 23.75,23.62 23.75,22.1 24.76,21.08 24.76,18.8 | 23.62,23.75 23.5,23.88 C6.2 | v30.61,17.02 29.34,15.75 29.34,12.95 28.57,12.19 28.07,12.19 | 28.07,12.19 v28.07,11.94 | v26.04,26.16 23.75,23.88 23.62,23.75 | 12.06,14.99 12.83,14.99 C2.2 | 12.06,14.99 11.3,14.99 | 11.3,14.99 11.05,14.99 C1.2 11.3,14.99 | 12.06,10.67 13.08,10.67 U$2.2 | 12.06,14.99 12.06,10.67 | 11.3,14.99 11.3,18.8 C3.2 11.3,19.05 11.3,20.83 IC1.1 11.05,20.83 3.43,20.83 IR/RELAY_SATELLITE.GND2 3.43,20.57 3.17,20.83 3.17,32.26 3.68,32.77 1RF.G@4 | 12.57,5.08 12.57,3.56 IR/RELAY_SATELLITE.GND | 12.57,5.08 12.57,7.37 R1.2 | 12.57,5.08 12.06,5.08 | 12.06,5.08 7.49,5.08 USB.GND | 12.57,5.08 IR/RELAY_SATELLITE.GND | 12.06,5.08 12.06,10.67 | 12.06,5.08 IR/RELAY_SATELLITE.GND | v3.94,39.88 3.94,38.35 1RF.G@1 | v14.61,31.5 14.61,28.45 U$11.4_GND | 36.45,1.78 ISP.6 | 36.45,1.78 ISP.6 | 36.45,1.78 37.97,3.3 v37.97,4.32 | 36.45,1.78 ISP.6 | v52.45,5.84 52.45,18.54 53.47,19.56 VCC.2 | 69.98,8.89 69.98,11.68 POWER_JACK.3 69.98,11.94 71.25,13.21 71.25,20.32 IR/RELAY_SATELLITE.GND3 71.25,20.57 70.99,20.83 70.99,38.1 73.02,38.1 FTDI.1 | 69.98,8.89 BATTTERY_AA.GND@1 69.98,8.89 | 69.98,8.89 BAT1.GND@1 | v41.78,19.81 v39.24,17.27
  Bottom 0.381: 1_RFM12.GND1 30.86,26.16 30.61,26.42 v28.57,26.42 28.32,26.67 26.54,26.67 v26.04,26.16 | U1.2 21.72,11.43 21.21,11.43 20.7,10.92 20.7,10.16 22.22,8.64 C8.2 22.48,8.64 23.24,9.4 25.02,9.4 26.29,10.67 26.8,10.67 R7.2 27.05,10.92 v28.07,11.94 | v30.61,17.02 30.86,17.02 32.13,15.75 R104.2 32.39,15.75 34.42,15.75 C105.2 34.67,15.75 36.2,17.27 v39.24,17.27 | v3.94,39.88 3.94,38.35 1RF.G@1 3.94,38.1 5.97,36.07 5.97,33.02 3.94,33.02 1RF.G@4 3.94,32.77 3.94,31.5 6.6,28.83 | 6.6,28.83 6.73,28.7 10.29,28.7 11.05,29.46 14.35,29.46 14.86,29.97 1_RFM12.GND 14.86,30.23 14.61,30.23 v14.61,31.5 | 21.08,15.88 20.19,16.76 15.88,16.76 8.51,24.13 1_RFM69.GND | 21.08,15.88 22.48,14.48 C7.2 | 1_RFM69.GND 8.51,24.38 1_RFM69.GND | 1_RFM69.GND 8.25,24.13 4.7,20.57 3.68,20.57 IR/RELAY_SATELLITE.GND2 | 6.6,28.83 6.48,28.7 6.48,27.18 6.22,27.18 5.46,26.42 5.46,24.38 8.25,24.38 1_RFM69.GND | v21.97,16.76 21.21,16 21.08,15.88 | 52.2,19.56 52.2,16 1_ATMEGA328.21 | 52.2,19.56 53.47,19.56 VCC.2 | 52.2,19.56 51.44,20.32 50.42,20.32 49.91,20.83 C107.2 49.66,21.08 47.88,21.08 C106.2 47.62,20.83 47.37,20.83 46.61,20.07 42.04,20.07 v41.78,19.81 | 51.44,4.06 55.25,4.06 56.01,3.3 C101.2 56.26,3.3 56.77,3.81 67.69,3.81 71.75,7.87 POWER_JACK.2 72.77,7.11 71.25,8.64 69.98,8.64 BATTTERY_AA.GND@1 | 51.44,4.06 42.55,4.06 41.78,3.3 C100.2 41.53,3.3 40.51,4.32 v37.97,4.32 | 51.44,4.06 51.44,6.1 | 51.44,6.1 51.44,7.11 1_ATMEGA328.5 | 51.44,6.1 52.45,6.1 | 52.45,6.1 52.96,6.1 52.96,7.11 1_ATMEGA328.3 | 52.45,6.1 v52.45,5.84 | FTDI.1 73.02,38.35 71.75,39.62 64.64,39.62 62.61,37.59 IR/RELAY_SATELLITE.GND1
  other vias: 22.96,3.47 20.76,6.37 23.46,5.97 16.86,7.37 28.26,4.37 29.56,6.37 32.16,9.77 49.06,2.77 45.46,3.77 43.06,4.47 45.56,6.77 49.56,9.07 50.06,11.67 53.36,3.67 59.56,4.37 66.36,15.07 58.96,13.97 61.16,15.37 43.78,20.21 38.36,7.17 39.36,8.37 34.66,17.27 38.96,1.57 25.37,13.56 16.57,16.16 20.16,15.87 1.67,6.76 18.06,29.07 29.06,29.17 19.86,27.77 22.36,29.97 53.88,36.11 36.58,24.31 36.28,29.81 39.16,30.07 18.66,38.67 47.86,29.97 51.46,24.82 48.81,23.82 20.76,37.37
  pour Bottom: -2.24,44.57 78.76,44.57 78.76,-3.43 -2.24,-3.43
  pour Top: -4.24,46.57 81.76,46.57 81.76,-5.43 -4.24,-5.43
N$1  (via drill 0.33)
  Top 0.152: v49.91,6.1 51.44,4.57 51.44,2.79 Q100.1
  Bottom 0.152: C101.1 56.01,1.52 54.99,2.54 51.69,2.54 Q100.1 | v49.91,6.1 49.91,7.11 1_ATMEGA328.7
N$2
  Top 0.152: R1.1 11.05,7.62 10.79,7.87 10.79,9.4 U$2.5
N$3
  Top 0.152: R3.2 8,27.43 7.24,26.67 7.24,25.91 6.73,25.4 4.44,25.4 4.44,27.43 IR-LED.A
N$4  (via drill 0.33)
  Top 0.152: v22.48,33.27 22.48,34.29 22.22,34.54 22.22,37.08 21.72,37.59 IC2.16 | v4.19,29.46 v5.72,30.99
  Bottom 0.152: v22.48,33.27 21.46,32.26 11.81,32.26 10.54,30.99 9.78,30.99 9.52,31.24 5.97,31.24 v5.72,30.99 | v4.19,29.46 2.41,27.69 1.91,27.69 IR-LED.K
N$5  (via drill 0.33)
  Top 0.152: v23.5,36.07 23.5,37.08 22.99,37.59 IC2.15 | v31.11,39.62 43.31,39.62 43.31,36.07 41.78,34.54 K1.5
  Bottom 0.152: v23.5,36.07 27.05,39.62 v31.11,39.62
N$6  (via drill 0.33)
  Top 0.152: v29.34,35.31 25.27,35.31 24.76,35.81 24.76,37.08 24.26,37.59 IC2.14
  Bottom 0.152: v29.34,35.31 29.59,35.05 33.4,35.05 33.91,34.54 K1.6
N$7  (via drill 0.33)
  Top 0.152: v47.37,6.6 46.86,6.1 46.86,2.79 Q100.2
  Bottom 0.152: C100.1 41.78,1.52 42.04,1.78 45.85,1.78 46.61,2.54 Q100.2 | v47.37,6.6 48.39,6.6 48.9,7.11 1_ATMEGA328.8
N$9  (via drill 0.33)
  Top 0.381: v14.35,20.83 13.08,20.83 IC1.2 | v19.18,18.29 20.7,18.29 3.3V_SUPPLY.3
  Bottom 0.381: v14.35,20.83 16.89,18.29 v19.18,18.29
N$10
  Bottom 0.635: K2.3 52.45,29.46 50.17,31.75 50.17,37.85 U$24.1
N$12
  Top 0.635: K1.4 41.53,32 40.01,33.53 40.01,36.32 41.53,37.85 U$22.2
N$13
  Top 0.635: K1.8 34.16,29.46 36.45,31.75 36.45,37.85 U$21.1
N$14
  Top 0.635: K1.7 33.91,32 32.39,33.53 32.39,35.05 33.91,36.58 33.91,37.85 U$21.2
N$15  (via drill 0.33)
  Top 0.152: v25.53,36.07 25.53,37.59 IC2.13 | v17.14,34.8 17.14,23.37 v17.4,23.11 | v44.07,19.05 45.59,20.57 45.59,21.34 47.12,22.86 54.23,22.86 54.23,32.77 52.71,34.29 K2.5
  Bottom 0.152: v25.53,36.07 24.26,34.8 v17.14,34.8 | v17.4,23.11 17.4,19.05 v44.07,19.05
N$16  (via drill 0.33)
  Top 0.152: v32.39,36.83 32.13,36.58 32.13,36.32 27.81,36.32 27.3,36.83 27.3,37.08 26.8,37.59 IC2.12
  Bottom 0.152: v32.39,36.83 32.89,36.32 43.05,36.32 44.83,34.54 K2.6
N$17
  Bottom 0.635: K2.8 45.09,29.46 47.37,31.75 47.37,37.85 U$23.1
N$18
  Top 0.635: K2.4 52.45,32 50.93,33.53 50.93,36.32 52.45,37.85 U$24.2
N$19
  Top 0.635: K2.7 45.09,32 46.86,33.78 46.86,36.07 45.09,37.85 U$23.2
N$20
  Top 0.635: K1.3 41.53,29.46 38.73,32.26 38.73,37.59 38.99,37.85 U$22.1
N$21
  Bottom 0.635: VCC_RELAIS_101.1 39.5,27.69 40.77,27.69 41.53,26.92 K1.2
N$22
  Top 0.152: R2.2 6.48,13.97 6.99,14.48 6.99,16 6.73,16.26 1.65,16.26 1.65,14.73 LED.K
N$23  (via drill 0.33)
  Top 0.381: 9.27,39.12 8.51,38.35 8.51,29.72 8.25,29.46 R3.1 | 19.56,34.92 19.43,34.8 18.67,34.8 RELAY_SUPPLY.2 | 19.56,34.92 19.94,35.31 19.94,37.57 19.94,39.12 19.94,39.37 29.85,39.37 30.35,38.86 30.35,37.85 IC2.9 | v27.81,25.65 25.53,27.94 v25.53,29.46 | v20.19,31.5 20.19,34.29 19.68,34.8 19.56,34.92 | K2.1 52.45,24.13 51.94,24.13 51.69,23.88 49.66,23.88 49.66,24.13 49.15,24.64 45.09,24.64 45.09,24.38 K2.10
  Top 0.406: 9.27,39.12 15.21,39.12 15.76,38.57 16.76,37.57 19.94,37.57
  Bottom 0.381: v27.81,25.65 28.07,25.4 29.08,25.4 29.59,24.89 33.4,24.89 33.91,24.38 K1.10 34.16,24.13 34.93,23.37 40.77,23.37 41.53,24.13 K1.1 41.78,24.13 44.83,24.13 K2.10 | v25.53,29.46 23.5,31.5 v20.19,31.5
N$24
  Bottom 0.635: VCC_RELAIS_103.1 50.42,27.69 51.69,27.69 52.45,26.92 K2.2
N$25
  Bottom 0.635: VCC_RELAIS_100.1 36.45,27.69 34.93,27.69 34.16,26.92 K1.9
N$26
  Bottom 0.635: VCC_RELAIS_102.2 47.37,27.69 45.85,27.69 45.09,26.92 K2.9
N$27  (via drill 0.33)
  Top 0.152: v23.24,10.41 21.97,9.14 v21.97,5.59
  Bottom 0.152: v23.24,10.41 21.97,10.41 U1.1 | v21.97,5.59 20.45,4.06 U$1.P$2
N$29
  Bottom 0.152: R6.2 27.05,13.97 27.05,12.7 R7.1 26.8,12.45 24.76,12.45 U1.4
SYS_RESET  (via drill 0.33)
  Top 0.152: v57.53,11.43 v57.53,1.27
  Bottom 0.152: C104.1 63.63,11.43 61.6,11.43 R102.2 61.34,11.43 v57.53,11.43 56.52,11.43 56.26,11.18 1_ATMEGA328.29 | v57.53,1.27 57.02,0.76 37.21,0.76 36.45,1.52 ISP.5
VCC  (via drill 0.33)
  Top 0.635: 22.48,25.65 23.24,25.65 C6.1 23.5,25.91 24.26,25.91 v24.76,26.42 | 22.48,25.65 21.72,24.89 20.95,24.89 LOAD_SUPPLY.2 | v18.92,30.89 18.92,32.77 18.67,33.02 RELAY_SUPPLY.1 | v22.46,28.45 22.48,27.43 22.48,25.91 22.48,25.65 | v39.24,24.64 39.5,24.38 v39.5,22.1 | v26.04,23.37 28.07,23.37 v28.07,22.61
  Bottom 0.635: v22.46,28.45 v18.92,30.89 | VCC_RELAIS_100.2 36.7,26.16 39.24,26.16 VCC_RELAIS_101.2 39.24,25.91 v39.24,24.64 | 49.15,26.16 50.17,26.16 VCC_RELAIS_103.2 | 49.15,26.16 47.62,26.16 VCC_RELAIS_102.1 | 45.97,22.73 49.15,25.91 49.15,26.16 | 45.97,22.73 45.59,22.35 39.75,22.35 v39.5,22.1 39.24,22.1 28.57,22.1 v28.07,22.61 | VCC.1 56.26,19.81 53.47,22.61 46.1,22.61 45.97,22.73 | v24.76,26.42 24.76,24.13 25.27,24.13 v26.04,23.37
VIN_1,4V_3.7V  (via drill 0.33)
  Top 0.152: 20.95,22.35 20.95,23.37 LOAD_SUPPLY.3 | 20.95,22.35 20.95,21.34 3.3V_SUPPLY.1 | v30.35,12.95 29.85,12.45 29.85,8.13 26.54,4.83 19.68,4.83 19.68,8.64 BATTTERY_AA.PWR@1 | v16.64,8.89 15.62,9.91 CHARGE.2 | v21.46,22.35 20.95,22.35 | v26.54,21.59 27.81,20.32 v27.81,17.27
  Bottom 0.152: 24.26,5.59 24.26,4.06 25.78,4.06 U$1.P$1 | 24.26,5.59 24.26,7.62 | 24.26,7.62 24.26,8.38 C8.1 | U1.6 24.51,10.67 24,10.67 22.99,11.68 22.99,12.19 21.97,12.19 U1.3 21.72,12.19 21.21,12.19 17.91,8.89 | v30.35,12.95 29.08,12.95 29.08,14.73 29.85,15.49 R103.1 29.85,15.75 29.34,15.75 v27.81,17.27 | 17.91,8.89 19.43,8.89 BATTTERY_AA.PWR@1 19.68,8.64 20.7,7.62 24.26,7.62 | 17.91,8.89 v16.64,8.89 | v21.46,22.35 22.22,21.59 v26.54,21.59 | 24.26,5.59 41.28,5.59 42.04,6.35 42.29,6.35 42.29,8.64 BAT1.PWR@1
VIN_5V_12V  (via drill 0.33)
  Top 0.152: 12.06,22.86 12.06,23.11 IC1.3 12.06,22.86 | 12.06,22.86 12.06,19.81 12.83,19.05 C3.1 12.83,18.8 12.57,18.54 v12.57,16 | v18.67,26.42 20.7,26.42 LOAD_SUPPLY.1 | 12.06,22.86 v13.08,22.86 | v9.78,13.46 10.79,13.46 10.79,13.21 C1.1 10.79,12.95 10.79,11.68 U$2.4 10.54,11.43 7.49,8.38 USB.VBUS | v69.98,31.5 70.23,31.24 70.23,24.13 67.69,21.59 67.69,13.46 66.93,12.7 66.93,7.11 POWER_JACK.1 66.67,6.86 66.67,0.51 42.04,0.51 39.5,3.05 39.5,7.1 36.45,10.14 36.45,17.02 v33.66,19.81
  Bottom 0.152: 17.14,24.89 15.11,22.86 v13.08,22.86 | 17.14,24.89 v18.67,26.42 | v9.78,13.46 12.57,13.46 | 12.57,13.46 18.92,13.46 19.18,13.21 PUMPED_VCC.2 | 12.57,13.46 v12.57,16 | v69.98,31.5 71.5,31.5 73.02,33.02 FTDI.3 | 17.14,24.89 21.46,20.57 22.48,20.57 23.5,19.56 33.4,19.56 v33.66,19.81
VIN_PUMPED  (via drill 0.33)
  Top 0.381: LOAD_SUPPLY.4 19.18,24.89 19.18,19.81 3.3V_SUPPLY.4 18.92,19.56 18.16,18.8 18.16,16.76 20.7,16.76 23.88,13.59 | 23.88,13.59 v25.78,11.68 | v23.5,13.21 23.75,13.46 23.88,13.59
  Bottom 0.381: R6.1 26.8,15.49 25.27,15.49 24.26,14.48 C7.1 24,14.22 23.37,13.59 | 23.37,13.59 22.99,13.21 21.97,13.21 20.95,14.22 19.68,14.22 19.43,14.48 PUMPED_VCC.1 | v25.78,11.68 24.76,11.68 U1.5 | v23.5,13.21 23.5,13.46 23.37,13.59
VOUT_3.7V
  Top 0.152: C2.1 13.08,12.95 13.08,11.68 U$2.3 13.34,11.43 15.37,11.43 CHARGE.1

### Text on the board
tNames: GND | VCC | TXD | RXD | DTR | GND | VCC | ADC1 | ADC2 | SDA | SDL | AA-BATTERY | CR-BATTERY | Version 1.0
bNames: SwitchPower | SwitchPower